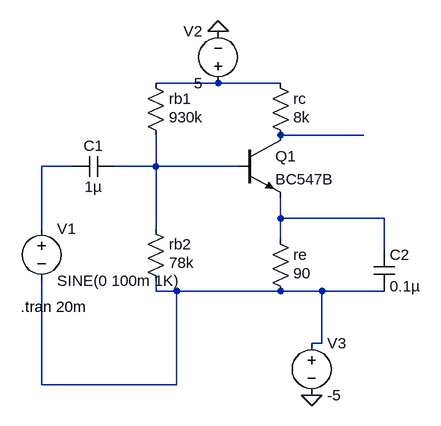
[diagram p0: schematic gain.asc]
gain.asc, the LTspice schematic file:
Version 4
SHEET 1 1048 680
WIRE 352 -16 256 -16
WIRE 448 -16 352 -16
WIRE 576 64 448 64
WIRE 128 112 80 112
WIRE 256 112 256 64
WIRE 256 112 192 112
WIRE 384 112 256 112
WIRE 448 192 448 160
WIRE 608 192 448 192
WIRE 80 208 80 112
WIRE 256 208 256 112
WIRE 448 224 448 192
WIRE 608 240 608 192
WIRE 256 304 256 288
WIRE 288 304 256 304
WIRE 448 304 288 304
WIRE 512 304 448 304
WIRE 608 304 512 304
WIRE 512 384 512 304
WIRE 512 384 496 384
WIRE 80 448 80 288
WIRE 288 448 288 304
WIRE 288 448 80 448
FLAG 352 -96 0
FLAG 496 464 0
SYMBOL cap 192 96 R90
WINDOW 0 0 32 VBottom 2
WINDOW 3 32 32 VTop 2
SYMATTR InstName C1
SYMATTR Value 1µ
SYMBOL voltage 80 192 R0
WINDOW 123 0 0 Left 0
WINDOW 39 0 0 Left 0
SYMATTR InstName V1
SYMATTR Value SINE(0 100m 1K)
SYMBOL npn 384 64 R0
SYMATTR InstName Q1
SYMATTR Value BC547B
SYMBOL res 432 -32 R0
WINDOW 3 36 68 Left 2
SYMATTR InstName rc
SYMATTR Value 8k
SYMBOL res 240 -32 R0
WINDOW 3 36 68 Left 2
SYMATTR InstName rb1
SYMATTR Value 930k
SYMBOL res 240 192 R0
WINDOW 3 36 68 Left 2
SYMATTR InstName rb2
SYMATTR Value 78k
SYMBOL res 432 208 R0
WINDOW 3 36 68 Left 2
SYMATTR InstName re
SYMATTR Value 90
SYMBOL voltage 352 0 R180
WINDOW 0 24 96 Left 2
WINDOW 3 24 16 Left 2
WINDOW 123 0 0 Left 0
WINDOW 39 0 0 Left 0
SYMATTR InstName V2
SYMATTR Value 5
SYMBOL cap 592 240 R0
SYMATTR InstName C2
SYMATTR Value 0.1µ
SYMBOL voltage 496 368 R0
WINDOW 123 0 0 Left 0
WINDOW 39 0 0 Left 0
SYMATTR InstName V3
SYMATTR Value -5
TEXT 48 328 Left 2 !.tran 20m

The netlist it stands for:
* gain.asc
C1 N004 N003 1µ
V1 N003 N006 SINE(0 100m 1K)
Q1 N002 N004 N005 0 BC547B
rc N001 N002 8k
rb1 N001 N004 930k
rb2 N004 N006 78k
re N005 N006 90
V2 N001 0 5
C2 N005 N006 0.1µ
V3 N006 0 -5
.model NPN NPN
.model PNP PNP
.lib standard.bjt
.tran 20m
.backanno
.end